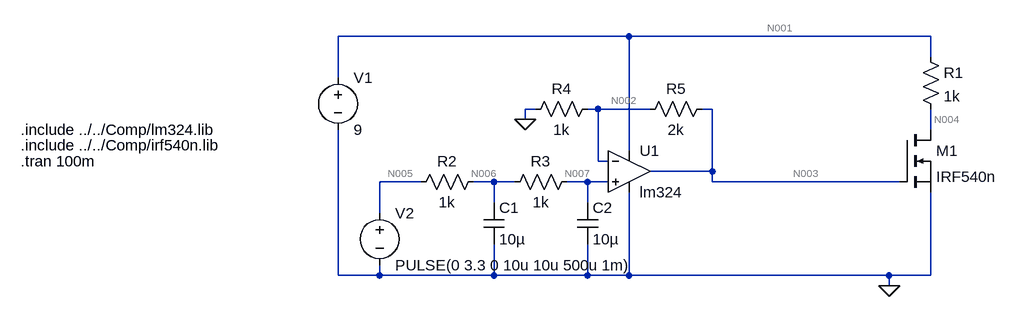
[diagram p0: schematic ActiveLoad_Rev01.asc]
ActiveLoad_Rev01.asc, the LTspice schematic file:
Version 4
SHEET 1 1268 968
WIRE -272 -128 -720 -128
WIRE 192 -128 -272 -128
WIRE 192 -96 192 -128
WIRE -720 -64 -720 -128
WIRE -416 -16 -432 -16
WIRE -320 -16 -336 -16
WIRE -240 -16 -320 -16
WIRE -144 -16 -160 -16
WIRE -432 0 -432 -16
WIRE 192 16 192 -16
WIRE -272 48 -272 -128
WIRE -320 64 -320 -16
WIRE -304 64 -320 64
WIRE -144 80 -144 -16
WIRE -144 80 -240 80
WIRE -592 96 -656 96
WIRE -480 96 -512 96
WIRE -448 96 -480 96
WIRE -336 96 -368 96
WIRE -304 96 -336 96
WIRE -144 96 -144 80
WIRE 144 96 -144 96
WIRE -480 128 -480 96
WIRE -336 128 -336 96
WIRE -656 144 -656 96
WIRE -720 240 -720 16
WIRE -656 240 -656 224
WIRE -656 240 -720 240
WIRE -480 240 -480 192
WIRE -480 240 -656 240
WIRE -336 240 -336 192
WIRE -336 240 -480 240
WIRE -272 240 -272 112
WIRE -272 240 -336 240
WIRE 128 240 -272 240
WIRE 192 240 192 112
WIRE 192 240 128 240
WIRE 128 256 128 240
FLAG 128 256 0
FLAG -432 0 0
SYMBOL voltage -720 -80 R0
WINDOW 123 0 0 Left 0
WINDOW 39 0 0 Left 0
SYMATTR InstName V1
SYMATTR Value 9
SYMBOL res 176 -112 R0
SYMATTR InstName R1
SYMATTR Value 1k
SYMBOL nmos 144 16 R0
SYMATTR InstName M1
SYMATTR Value IRF540n
SYMATTR Prefix X
SYMBOL voltage -656 128 R0
WINDOW 123 0 0 Left 0
WINDOW 39 0 0 Left 0
SYMATTR InstName V2
SYMATTR Value PULSE(0 3.3 0 10u 10u 500u 1m)
SYMBOL OpAmps\\opamp2 -272 16 R0
SYMATTR InstName U1
SYMATTR Value lm324
SYMBOL res -496 80 R90
WINDOW 0 0 56 VBottom 2
WINDOW 3 32 56 VTop 2
SYMATTR InstName R2
SYMATTR Value 1k
SYMBOL res -352 80 R90
WINDOW 0 0 56 VBottom 2
WINDOW 3 32 56 VTop 2
SYMATTR InstName R3
SYMATTR Value 1k
SYMBOL cap -496 128 R0
SYMATTR InstName C1
SYMATTR Value 10µ
SYMBOL cap -352 128 R0
SYMATTR InstName C2
SYMATTR Value 10µ
SYMBOL res -320 -32 R90
WINDOW 0 0 56 VBottom 2
WINDOW 3 32 56 VTop 2
SYMATTR InstName R4
SYMATTR Value 1k
SYMBOL res -144 -32 R90
WINDOW 0 0 56 VBottom 2
WINDOW 3 32 56 VTop 2
SYMATTR InstName R5
SYMATTR Value 2k
TEXT -1208 64 Left 2 !.tran 100m
TEXT -1208 16 Left 2 !.include ../../Comp/lm324.lib
TEXT -1208 40 Left 2 !.include ../../Comp/irf540n.lib

The netlist it stands for:
* ActiveLoad_Rev01.asc
V1 N001 0 9
R1 N001 N004 1k
XM1 N004 N003 0 IRF540n  ; pins D G S
V2 N005 0 PULSE(0 3.3 0 10u 10u 500u 1m)
XU1 N007 N002 N001 0 N003 lm324  ; pins In+ In- V+ V- OUT
R2 N006 N005 1k
R3 N007 N006 1k
C1 N006 0 10µ
C2 N007 0 10µ
R4 N002 0 1k
R5 N003 N002 2k
.tran 100m
.include ../../Comp/lm324.lib
.include ../../Comp/irf540n.lib
.backanno
.end

* Results of the author's LTspice run, read from the files saved beside the schematic
* Operating Point, zero values left out:
*   V(n001) = 9 V
*   V(n004) = 8.991 V
*   V(n003) = 47 mV
*   V(n002) = 15.68 mV
*   V(n007) = 48.67 µV
*   V(n006) = 24.34 µV
*   I(R5) = 15.66 µA
*   I(R4) = 15.68 µA
*   I(R3) = 24.34 nA
*   I(R2) = 24.34 nA
*   I(R1) = 8.991 µA
*   I(V2) = 24.34 nA
*   I(V1) = -316 µA
*   Ix(m1:1) = 8.991 µA
*   Ix(m1:2) = -8.944 pA
*   Ix(m1:3) = -8.991 µA
*   Ix(u1:1) = -24.34 nA
*   Ix(u1:2) = -16.44 nA
*   Ix(u1:3) = 307 µA
*   Ix(u1:4) = -305.6 µA
*   Ix(u1:5) = -15.66 µA
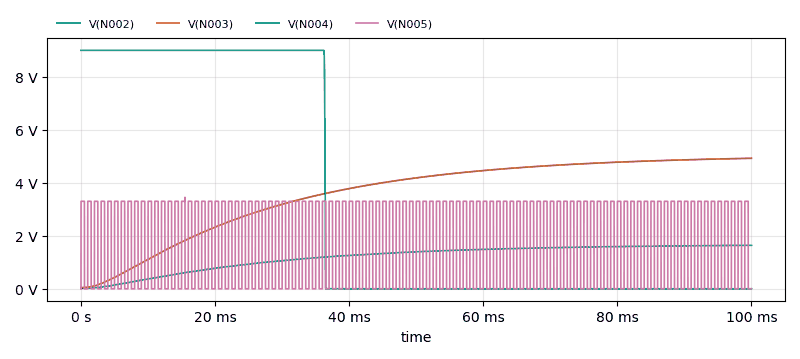
[diagram p1: Transient Analysis of ActiveLoad_Rev01.asc, plotted from the saved traces]
* Transient Analysis, 1 run:
*   V(N002): min 15.68 mV, max 1.641 V, average 1.194 V, rms 1.285 V, last 1.64 V
*   V(N003): min 47 mV, max 4.922 V, average 3.581 V, rms 3.854 V, last 4.921 V
*   V(N004): min 410.6 µV, max 8.991 V, average 3.273 V, rms 5.422 V, last 410.6 µV
*   V(N005): min 0 V, max 3.449 V, average 1.683 V, rms 2.352 V, last 0 V